# Altium project Barun Gas Control.PrjPcb
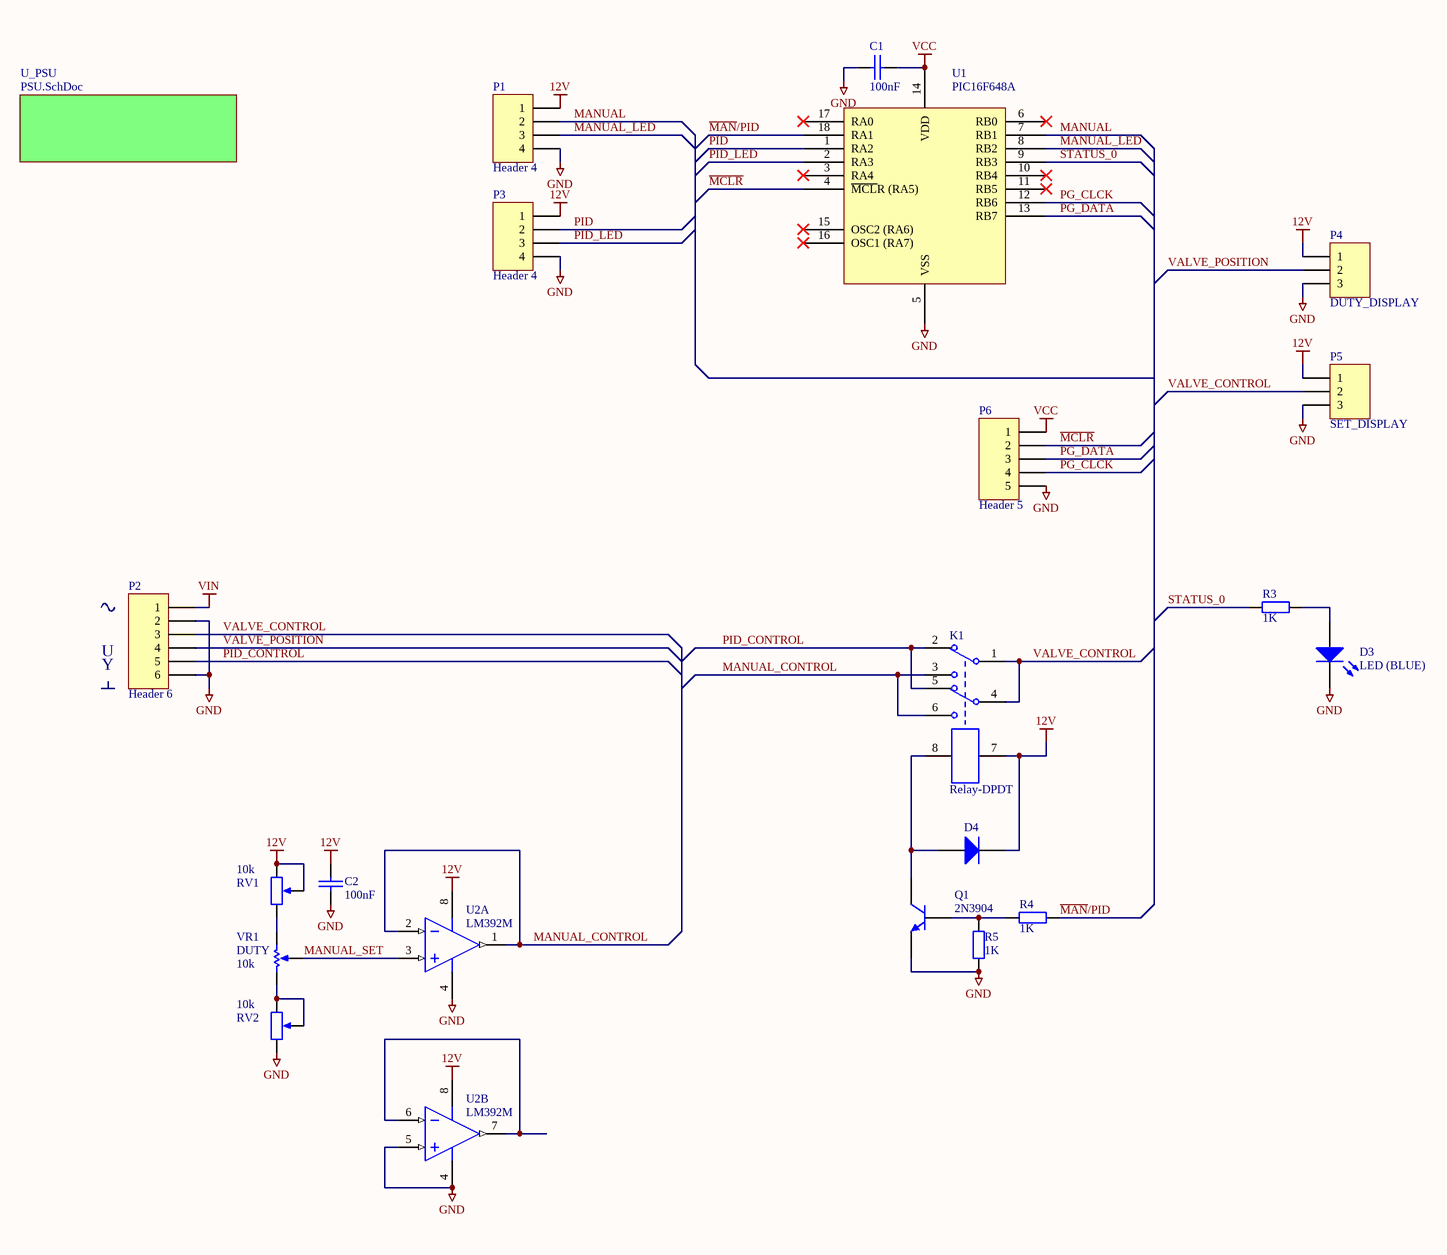
[diagram p0: Barun Gas Control.SchDoc]
2 sheets, 36 parts. Net scope: global (net labels, ports and power ports of the same name join across sheets).
Board files: Barun Gas Control Top Panel V3.PcbDoc, Barun Gas Control.PcbDoc, Barun Gas Control V2a.PcbDoc
Sheets:
  Barun Gas Control.SchDoc
    U_PSU = psu.schdoc

## Sheet Barun Gas Control.SchDoc
size A3

### Parts
C1  100nF  [CAP RADIAL 0.200]
C2  100nF  [CAP RADIAL 0.200]
D3  LED (BLUE)  [LED(3D) 5MM VERTICAL (GREEN)]
D4  Diode 1N4148  [DO-35]  (value not drawn)
K1  Relay-DPDT  [RELAY DPDT]
P1  Header 4  [HDR1X4]
P2  Header 6  [6 x 5.08mm]
P3  Header 4  [HDR1X4]
P4  DUTY_DISPLAY  [HDR1X3]
P5  SET_DISPLAY  [HDR1X3]
P6  Header 5  [HDR1X5]
Q1  2N3904  [TO-92A]
R3  value 1K  [AXIAL-0.4]  (hidden comment: Res2)
R4  value 1K  [AXIAL-0.4]  (hidden comment: Res2)
R5  value 1K  [AXIAL-0.4]  (hidden comment: Res2)
RV1  10k  [TRIMMER]
RV2  10k  [TRIMMER]
U1  PIC16F648A  [DIP-18]
U2  LM392M  [DIP_8]  (parts A,B of 2)
VR1  DUTY  value 10k  [HDR1X3]

### Sub-sheets
U_PSU = PSU.SchDoc: no entries

### Nets
12V: C2.2 D4.2(K) K1.7 P1.1 P3.1 P4.1 P5.1 RV1.1 RV1.2 U2.8(V+)
GND: C1.1 C2.1 D3.2(K) P1.4 P2.2 P2.6 P3.4 P4.3 P5.3 P6.5 Q1.1(E) R5.1 RV2.3 U1.5(VSS) U2.4(GND) U2.5(INB+)
VCC: C1.2 P6.1 U1.14(VDD)
VIN: P2.1
~{MCLR}: P6.2 U1.4(~{MCL}R_(RA5))
~{MAN}/PID: R4.1 U1.18(RA1)
MANUAL: P1.2 U1.7(RB1)
MANUAL_CONTROL: K1.3 K1.6 U2.1(OUTA) U2.2(INA-)
MANUAL_LED: P1.3 U1.8(RB2)
MANUAL_SET: U2.3(INA+) VR1.3(TAP)
PG_CLCK: P6.4 U1.12(RB6)
PG_DATA: P6.3 U1.13(RB7)
PID: P3.2 U1.1(RA2)
PID_CONTROL: K1.2 K1.5 P2.5
PID_LED: P3.3 U1.2(RA3)
STATUS_0: R3.2 U1.9(RB3)
VALVE_CONTROL: K1.1 K1.4 P2.3 P5.2
VALVE_POSITION: P2.4 P4.2
NetD3_1: D3.1(A) R3.1
NetD4_1: D4.1(A) K1.8 Q1.3(C)
NetQ1_2: Q1.2(B) R4.2 R5.2
NetRV1_3: RV1.3 VR1.1(TOP)
NetRV2_1: RV2.1 RV2.2 VR1.2(BOT)
NetU2_6: U2.6(INB-) U2.7(OUTB)

Not connected (* = marked no-connect by the designer): U1 3(RA4)* 6(RB0)* 10(RB4)* 11(RB5)* 15(OSC2_(RA6))* 16(OSC1_(RA7))* 17(RA0)*

### Notes on the sheet
- Y
- U

### Library data of the parts
C1 C2 = CAP: CAPACITOR SMD 0402; value: 100nF; Supplier 1: Mouser; Supplier Part Number 1: 810-CGJ3E2X7R1H104K
D3 = LED 3mm RED: 3mm RED LED; Manufacturer: Kingbright; Manufacturer Part No.: WP132XIT; Mouser Part no.: 604-WP132XIT; Farnell Part no.: 1003393; Web link: http://au.mouser.com/Search/Refine.aspx?Keyword=604-WP132XIT
D4 = Diode 1N4148: High Conductance Fast Diode; Published: 8-Jun-2000; LatestRevisionDate: 17-Jul-2002; LatestRevisionNote: Re-released for DXP Platform.; DatasheetVersion: 1997; PackageReference: DO-35; Publisher: Altium Limited; PackageDescription: Diode, Axial; Body 3.8 x 1.9 mm (LxDia. max), Lead Dia. 0.53 mm (max); Code_JEDEC: DO-204-AH; ComponentLink1Description: Manufacturer Link; ComponentLink1URL: http://www.fairchildsemi.com/; ComponentLink2Description: Datasheet; ComponentLink2URL: http://www.fairchildsemi.com/ds/1N%2F1N4148.pdf
K1 = Relay-DPDT: DS2Y-S-DC12V; pin to pad: 1>3 3>1 4>6 6>4; Manufacturer: Generic Components; Revision: July-2002: Re-released for DXP Platform.; Manufacturer: DS2Y-S-DC12V; Manufacturer Part No.: DS2Y-S-DC12V; Web Link: http://www.forward-relays.com/doce/products/product_detail.asp?catalogid=&productid=93
P1 P3 = Header 4: Header, 4-Pin; LatestRevisionDate: 17-Jul-2002; LatestRevisionNote: Re-released for DXP Platform.; Publisher: Altium Limited
P2 = Header 6: Header, 6-Pin; LatestRevisionDate: 17-Jul-2002; LatestRevisionNote: Re-released for DXP Platform.; Publisher: Altium Limited
P4 P5 = Header 3: Header, 3-Pin; LatestRevisionDate: 17-Jul-2002; LatestRevisionNote: Re-released for DXP Platform.; Publisher: Altium Limited
P6 = Header 5: Header, 5-Pin; LatestRevisionDate: 17-Jul-2002; LatestRevisionNote: Re-released for DXP Platform.; Publisher: Altium Limited
Q1 = 2N3904: NPN General Purpose Amplifier; Published: 8-Jun-2000; LatestRevisionDate: 15-Jan-2003; LatestRevisionNote: PCB Footprint 'BCY-W3/D4.7' replaced; DatasheetVersion: 1997; PackageVersion: Sep-1998; PackageReference: TO-92A; Publisher: Altium Limited; PackageDescription: TO, Flat Index; 3 In-Line, Axial Leads; Body Dia. 4.5mm; Leads 0.51 x 0.48 mm (max); ComponentLink1Description: Manufacturer Link; ComponentLink1URL: http://www.fairchildsemi.com/; ComponentLink2Description: Datasheet; ComponentLink2URL: http://www.fairchildsemi.com/ds/2N%2F2N3904.pdf
R3-R5 = Res2: Resistor; Published: 8-Jun-2000; LatestRevisionDate: 17-Jul-2002; LatestRevisionNote: Re-released for DXP Platform.; PackageReference: AXIAL-0.4; Publisher: Altium Limited; PackageDescription: Axial Device, Thru-Hole; 2 Leads; 0.4 in Pin Spacing
RV1 RV2 = VAR (POT) SMD: Variable Resistor; Series: PVZ3A; Value: 10k
U1 = PIC16F87/88: PIC16F88; Manufacturer: Microchip Technology; Manufacturer Part No.: PIC16F88-E/SS; Mouser Part no.: 579-PIC16F88-E/SS; Farnell Part no.: 9761519; value: PIC16F88; Web link: http://au.mouser.com/ProductDetail/Microchip-Technology/PIC16F88-E-SS/?qs=sGAEpiMZZMvu0Nwh4cA1waDrdroEY0RCb%252bRi%252b4Dz0K0%3d
U2 = LM392M: Low Power Operational Amplifier/Voltage Comparator, 8-pin Narrow SOIC; Manufacturer: National Semiconductor; PackageTopMarking: NSZXTT*LM392*M; PowerWise: N; CompType: Amplifiers; Published: 4-Dec-2008; LatestRevisionDate: 13-Jan-2009; LatestRevisionNote: Sim Model Added.; DatasheetVersion: Aug-2000; PackageVersion: revM, May-2009; PackageReference: M08A; Publisher: Altium Limited; PackageDescription: SOIC Narrow, 4.9 x 3.9 x 1.45mm, 8 Lead, 1.27mm Pitch; Supplier 1: Digi-Key; Supplier Part Number 1: LM392M-ND; Supplier 2: Farnell; Supplier Part Number 2: 9486755; PartNumber: LM392M; RoHS: N; PinCount: 8; Code_JEDEC: MS-012-AA; Code_IPC: SOIC127P600-8; ComponentLink1Description: LM392 Datasheet; ComponentLink1URL: http://www.national.com/ds/LM/LM392.pdf; ComponentLink2Description: LM392 Web Page; ComponentLink2URL: http://www.national.com/pf/LM/LM392.html; ComponentLink3Description: M08A Package Page; ComponentLink3URL: http://www.national.com/packaging/folders/m08a.html
VR1 = RPot: Potentiometer; pin to pad: 2>3 3>2; Sim Note: Enter the Resistance value and the set point into parameter fields.; Set Position: 0.5; Published: 8-Jun-2000; LatestRevisionDate: 17-Jul-2002; LatestRevisionNote: Re-released for DXP Platform.; PackageReference: VR5; Publisher: Altium Limited; PackageDescription: Variable Resistor, Thru-Hole; 3 Leads

## Sheet psu.schdoc
size A4
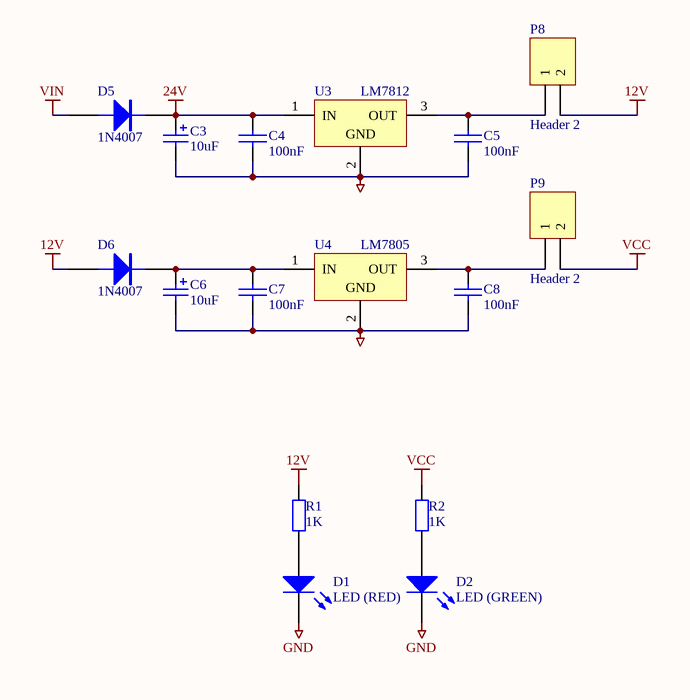
[diagram p1: psu.schdoc]

### Parts
C3  10uF  [RB7.6-15]
C4  100nF  [CAP RADIAL 0.200]
C5  100nF  [CAP RADIAL 0.200]
C6  10uF  [RB7.6-15]
C7  100nF  [CAP RADIAL 0.200]
C8  100nF  [CAP RADIAL 0.200]
D1  LED (RED)  [LED(3D) 5MM VERTICAL (GREEN)]
D2  LED (GREEN)  [LED(3D) 5MM VERTICAL (GREEN)]
D5  1N4007  [DO-35]
D6  1N4007  [DO-35]
P8  Header 2  [HDR1X2]
P9  Header 2  [HDR1X2]
R1  value 1K  [AXIAL-0.4]  (hidden comment: Res2)
R2  value 1K  [AXIAL-0.4]  (hidden comment: Res2)
U3  LM7812  [TO-220]
U4  LM7805  [TO-220]

### Nets
12V: D6.1(A) P8.2 R1.1
24V: C3.1 C4.1 D5.2(K) U3.1(IN)
GND: C3.2 C4.2 C5.2 C6.2 C7.2 C8.2 D1.2(K) D2.2(K) U3.2(GND) U4.2(GND)
VCC: P9.2 R2.1
VIN: D5.1(A)
NetC5_1: C5.1 P8.1 U3.3(OUT)
NetC6_1: C6.1 C7.1 D6.2(K) U4.1(IN)
NetC8_1: C8.1 P9.1 U4.3(OUT)
NetD1_1: D1.1(A) R1.2
NetD2_1: D2.1(A) R2.2

### Library data of the parts
C3 C6 = Cap Pol: CAPACITOR POLARISED TAG B CASE; Manufacturer: Vishay/Sprague; Manufacturer Part No.: 591D106X9020B2T15H; value: 10uF; Mouser Part no.: 71-591D106X9020B2T15; Web link: http://au.mouser.com/ProductDetail/Vishay-Sprague/591D106X9020B2T15H/?qs=sGAEpiMZZMuEN2agSAc2pvHIaWFtjSV0lDKOXo3DDxQ%3d
C4 C5 C7 C8 = CAP: CAPACITOR SMD 0603; Manufacturer: Murata; Manufacturer Part No.: GCM188R71C104KA37D; value: 100nF; Mouser Part no.: 81-GCM188R71C104KA7D; Web link: http://au.mouser.com/ProductDetail/Murata/GCM188R71C104KA37D/?qs=aEuGZpxfbxWKAxwYn%252beTMg%3d%3d
D1 D2 = LED 3mm RED: as D3 on sheet Barun Gas Control; Mouser Part no.: 604-WP132XIT; Farnell Part no.: 1003393; Web link: http://au.mouser.com/Search/Refine.aspx?Keyword=604-WP132XIT
D5 D6 = DIODE: DIODE, POWER; Manufacturer: TAIWAN SEMI; Manufacturer Part No.: S1M; value: S1M; Mouser Part no.: 821-S1M; Web link: http://au.mouser.com/ProductDetail/Taiwan-Semiconductor/S1M/?qs=sGAEpiMZZMtEwUVCuofpuOlSmRjzJonf%252bmrIm0%252bGbjE%3d
P8 P9 = Header 2: Header, 2-Pin; LatestRevisionDate: 17-Jul-2002; LatestRevisionNote: Re-released for DXP Platform.; Publisher: Altium Limited
R1 R2 = Res2: Resistor; Published: 8-Jun-2000; LatestRevisionDate: 17-Jul-2002; LatestRevisionNote: Re-released for DXP Platform.; PackageReference: AXIAL-0.4; Publisher: Altium Limited; PackageDescription: Axial Device, Thru-Hole; 2 Leads; 0.4 in Pin Spacing
U3 = MC7805ACT: 3-Terminal Positive Fixed Voltage Regulator; Manufacturer: Fairchild Semiconductor; Value: LM7812; Manufacturer Part No.: LM7812; Web link: http://au.mouser.com/ProductDetail/Fairchild-Semiconductor/LM7805CT/?qs=sGAEpiMZZMtUqDgmOWBjgPJMQlYvsHAW%252bBbwCYnQla0%3d
U4 = MC7805ACT: 3-Terminal Positive Fixed Voltage Regulator; Manufacturer: Fairchild Semiconductor; Manufacturer Part No.: LM7805CT; Mouser Part No.: 512-LM7805CT; Value: LM7805; Web link: http://au.mouser.com/ProductDetail/Fairchild-Semiconductor/LM7805CT/?qs=sGAEpiMZZMtUqDgmOWBjgPJMQlYvsHAW%252bBbwCYnQla0%3d

## Nets that join several sheets
12V: Barun Gas Control (10 pins), psu (D6.1 P8.2 R1.1)
GND: Barun Gas Control (16 pins), psu (10 pins)
VCC: Barun Gas Control (C1.2 P6.1 U1.14), psu (P9.2 R2.1)
VIN: Barun Gas Control (P2.1), psu (D5.1)